# EAGLE design motorCTRL (EAGLE 9.6.2)
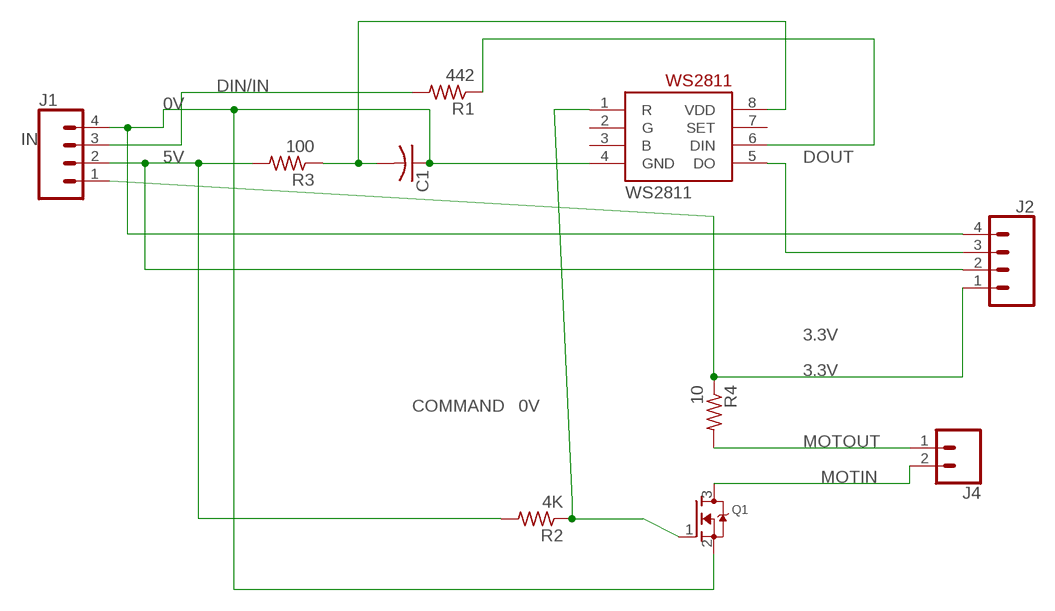
[diagram p0: schematic, sheet 1]

## Parts
C1  C-USC0805  [C0805]
J1  CONN_04  [1X04]
J2  CONN_04  [1X04]
J4  CONN_02  [1X02]
Q1  MOSFET-NREFLOW  [SOT23]
R1  442  R-US_R0805  [R0805]
R2  4K  R-US_R0805  [R0805]
R3  100  R-US_R0805  [R0805]
R4  10  R-US_R0805  [R0805]
WS2811  WS2811-SOP8  [SO08-SKINNYPADS]

## Nets
0V: C1.1 J1.4 J2.4 Q1.2(S) WS2811.4(GND)
3.3V: J1.1 J2.1 R4.1
5V: J1.2 J2.2 R2.2 R3.2
COMMAND: Q1.1(G) R2.1 WS2811.1(R)
DIN/IN: J1.3 R1.2
DOUT: J2.3 WS2811.5(DO)
MOTIN: J4.2 Q1.3(D)
MOTOUT: J4.1 R4.2
N$1: R1.1 WS2811.6(DIN)
VCC: C1.2 R3.1 WS2811.8(VDD)
Unconnected: WS2811.2(G) WS2811.3(B) WS2811.7(SET)

## Library data of the parts
C1 = adafruit:C-US: CAPACITOR, American symbol
J1 J2 = SparkFun-Connectors:CONN_04: Multi connection point. Often used as Generic Header-pin footprint for 0.1 inch spaced/style header connections On any of the 0.1 inch spaced packages, you can populate with these: Break Away Headers - Straight <https://www.sparkfun.com/products/116> (PRT-00116) Break Away Male Headers - Right Angle <https://www.sparkfun.com/products/553> (PRT-00553) Female Headers <https://www.sparkfun.com/products/115> (PRT-00115) Break Away Headers - Machine Pin <https://www.sparkfun.com/products/117> (PRT-00117) Break Away Female Headers - Swiss Machine Pin <https://www.sparkfun.com/products/743> (PRT-00743) For SCREWTERMINALS and SPRING TERMINALS visit here: Screw Terimnals on SparkFun.com <https://www.sparkfun.com/search/results?term=Screw+Terminals> (5mm/3.5mm/2.54mm spacing) This device is also useful as a general connection point to wire up your design to another part of your project. Our various solder wires solder well into these plated through hole pads. Hook-Up Wire - Assortment (Stranded, 22 AWG) <https://www.sparkfun.com/products/11375> (PRT-11375) Hook-Up Wire - Assortment (Solid Core, 22 AWG) <https://www.sparkfun.com/products/11367> (PRT-11367) View the entire wire category on our website here <https://www.sparkfun.com/categories/141> Special notes: Molex polarized connector foot print use with SKU : PRT-08231 with associated crimp pins and housings. 1MM SMD Version SKU: PRT-10208; PROD_ID: CONN-09696
J4 = SparkFun-Connectors:CONN_02: Multi connection point. Often used as Generic Header-pin footprint for 0.1 inch spaced/style header connections On any of the 0.1 inch spaced packages, you can populate with these: Break Away Headers - Straight <https://www.sparkfun.com/products/116> (PRT-00116) Break Away Male Headers - Right Angle <https://www.sparkfun.com/products/553> (PRT-00553) Female Headers <https://www.sparkfun.com/products/115> (PRT-00115) Break Away Headers - Machine Pin <https://www.sparkfun.com/products/117> (PRT-00117) Break Away Female Headers - Swiss Machine Pin <https://www.sparkfun.com/products/743> (PRT-00743) For SCREWTERMINALS and SPRING TERMINALS visit here: Screw Terimnals on SparkFun.com <https://www.sparkfun.com/search/results?term=Screw+Terminals> (5mm/3.5mm/2.54mm spacing) This device is also useful as a general connection point to wire up your design to another part of your project. Our various solder wires solder well into these plated through hole pads. Hook-Up Wire - Assortment (Stranded, 22 AWG) <https://www.sparkfun.com/products/11375> (PRT-11375) Hook-Up Wire - Assortment (Solid Core, 22 AWG) <https://www.sparkfun.com/products/11367> (PRT-11367) View the entire wire category on our website here <https://www.sparkfun.com/categories/141> Special notes: Molex polarized connector foot print use with: PRT-08233 with associated crimp pins and housings. 2.54_SCREWTERM for use with PRT-10571. 3.5mm Screw Terminal footprints for PRT-08084 5mm Screw Terminal footprints for use with PRT-08432
Q1 = adafruit:MOSFET-N: N-Channel Mosfet 2N7002E - 60V 260mA SOT23 [Digikey: 2N7002ET1GOSTR-ND] - REEL BSH103 - 30V 850mA SOT23 [Digikey: 568-5013-1-ND]
R1-R4 = adafruit:R-US_: RESISTOR, American symbol
WS2811 = adafruit:WS2811

## Board
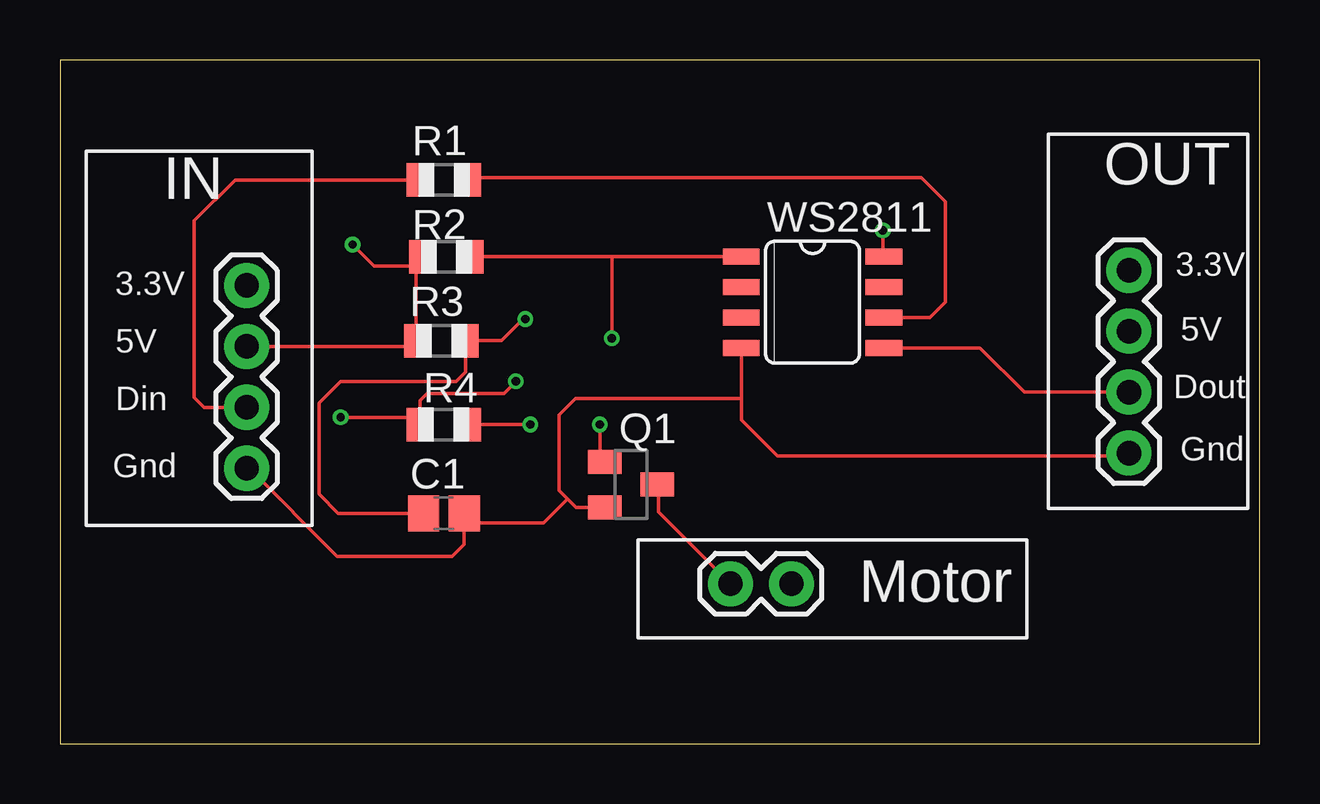
[diagram p1: board, top side]
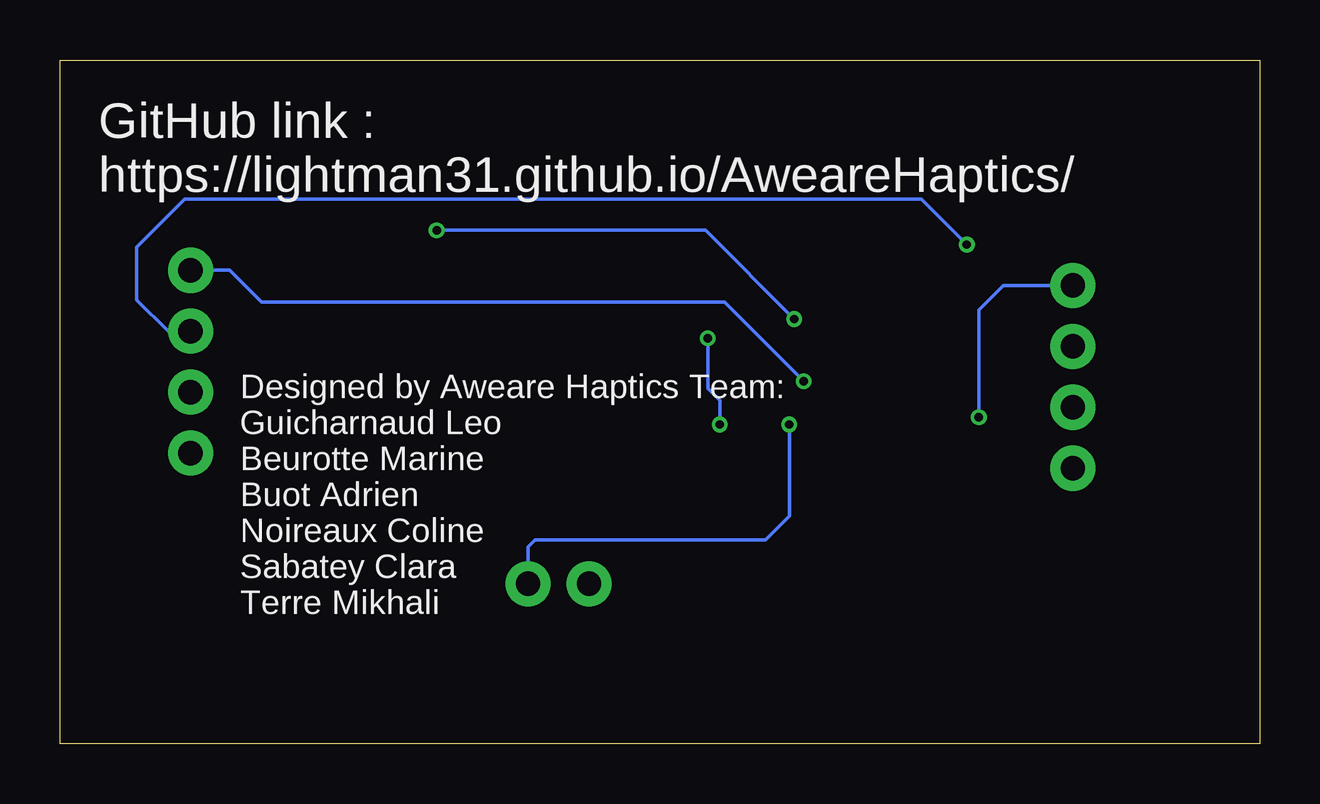
[diagram p2: board, bottom side, seen from below]

Size 50 x 28.5 mm. Coordinates in mm from the lower left corner, seen from the top.
Outline: 0,0 50,0 50,28.5 0,28.5 0,0
Copper layers (1*16): Top 0.035mm / dielectric 1.5mm / Bottom 0.035mm
Design rules "JLCPCB_2layer_DRU_no_angle_5mil": minimum track width 5mil, minimum drill 0.3mm, track to track 5mil, track to pad 5mil, pad to pad 5mil, via to via 5mil, smd to smd 0mil, copper to edge 10mil, drill to drill 10mil, minimum pad ring 10mil, minimum via ring 6mil, stop-mask expansion 2mil, vias tented up to drill 100mil, thermal gap 10mil

### Footprints (pad centres in the part's own frame; a part is rotated, then mirrored left to right if it is on the bottom)
C0805 = smd 1.3 x 1.5: 1 -0.85,0; 2 0.85,0
1X04 = drill 1.016 pad 1.88: 1 0,0; 2 2.54,0; 3 5.08,0; 4 7.62,0
1X02 = drill 1.016 pad 1.88: 1 0,0; 2 2.54,0
SOT23 = smd 1 x 1.4: 1 -0.95,-1.1; 2 0.95,-1.1; 3 0,1.1
R0805 = smd 1.1 x 1.4: 1 -1,0; 2 1,0
SO08-SKINNYPADS = smd 0.66 x 1.524: 1 -1.905,-2.973; 2 -0.635,-2.973; 3 0.635,-2.973; 4 1.905,-2.973; 5 1.905,2.973; 6 0.635,2.973; 7 -0.635,2.973; 8 -1.905,2.973

### Placement (x,y rotation side)
C1  16,9.6 180 top
J1  7.78,19.1 270 top
J2  44.56,19.73 270 top
J4  30.49,6.66 180 top
Q1  23.8,10.8 270 top
R1  16,23.5 180 top
R2  16.1,20.3 180 top
R3  15.9,16.8 180 top
R4  16,13.3 0 top
WS2811  31.37,18.4 270 top

### Tracks (layer width: path | path; a pad name or v marks a point on that pad's centre or on a via)
0V
  Top 0.152: Q1.2 21.5,9.85 21.15,10.2 | 21.15,10.2 20.15,9.2 17.25,9.2 C1.1 16.85,8.3 16.35,7.8 11.56,7.8 7.88,11.48 J1.4 | 21.15,10.2 20.8,10.55 20.8,13.7 21.5,14.39 28.4,14.39 WS2811.4 28.4,13.5 29.9,12 44.45,12 J2.4
3.3V  (via drill 0.35)
  Top 0.152: v11.7,13.6 15,13.6 R4.1 15,14.3 15.3,14.6 18.5,14.6 v19,15.1
  Bottom 0.152: v11.7,13.6 11.7,18.08 10.68,19.1 J1.1 | v19,15.1 22.3,18.4 41.6,18.4 42.93,19.73 J2.1
5V  (via drill 0.35)
  Top 0.152: 14.85,16.75 14.85,20.3 R2.2 14.7,19.9 13.1,19.9 v12.2,20.8 | R3.2 14.85,16.75 | 14.85,16.75 14.85,16.56 J1.2
  Bottom 0.152: v12.2,20.8 14.1,22.7 17.1,22.7 | J2.2 45.49,17.19 46.8,18.5 46.8,20.7 44.8,22.7 17.1,22.7 | 17.1,22.7
COMMAND  (via drill 0.35)
  Top 0.152: WS2811.1 23.7,20.3 23,20.3 | R2.1 23,20.3 | Q1.1 22.5,11.95 v22.5,13.3 | v23,16.9 23,20.3
  Bottom 0.152: v23,16.9 23,14.8 22.5,14.3 v22.5,13.3
DIN/IN
  Top 0.152: J1.3 6,14.02 5.6,14.42 5.6,21.8 7.3,23.5 R1.2
DOUT
  Top 0.152: J2.3 40.19,14.65 38.34,16.49 WS2811.5
MOTIN
  Top 0.152: J4.2 24.95,9.66 24.95,10.75 Q1.3
MOTOUT  (via drill 0.35)
  Top 0.152: R4.2 v19.6,13.3
  Bottom 0.152: v19.6,13.3 19.6,9.5 20.6,8.5 30.19,8.5 30.49,8.2 J4.1
N$1
  Top 0.152: R1.1 17.1,23.6 35.9,23.6 36.9,22.6 36.9,18.4 36.27,17.77 WS2811.6
VCC  (via drill 0.35)
  Top 0.152: v19.4,17.7 19.3,17.7 18.4,16.8 R3.1 16.9,15.5 16.5,15.1 11.7,15.1 10.8,14.2 10.8,10.4 11.6,9.6 C1.2 | v34.3,21.4 34.3,20.35 WS2811.8
  Bottom 0.152: v19.4,17.7 23.1,21.4 v34.3,21.4

### Text on the board
tPlace: OUT | IN | 3.3V | 3.3V | 5V | 5V | Dout | Din | Gnd | Gnd | Motor
bPlace: GitHub link : / https://lightman31.github.io/AweareHaptics/ | Designed by Aweare Haptics Team: / Guicharnaud Leo / Beurotte Marine / Buot Adrien / Noireaux Coline / Sabatey Clara / Terre Mikhali